# Altium schematic sheet LeftEar.SchDoc
size A4; SheetNumber: 1; SheetTotal: 2
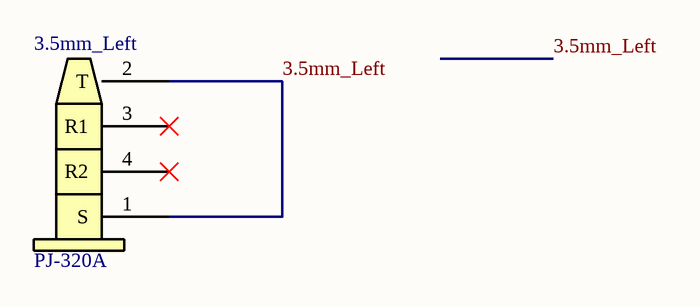
[diagram p0: LeftEar.SchDoc]

## Parts
3.5mm_Left  PJ-320A  [PCBComponent_1]

## Nets
3.5mm_Left: 3.5mm_Left.1(S) 3.5mm_Left.2(T)

Not connected (* = marked no-connect by the designer): 3.5mm_Left 3(R1)* 4(R2)*

## Library data of the parts
3.5mm_Left = PJ-320A: A thru hole 3.5mm TRRS audio jack connector